# EAGLE design Foot.SMD.V1 (EAGLE 7.1.0)
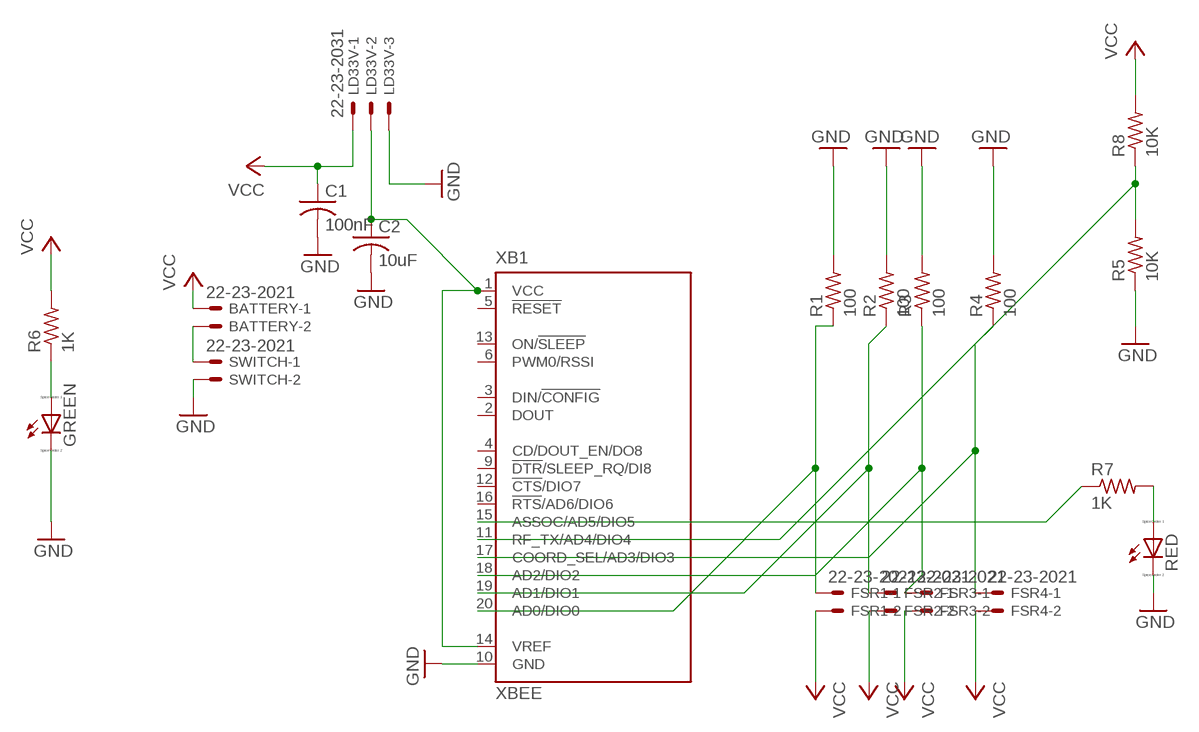
[diagram p0: schematic, sheet 1]

## Parts
BATTERY  22-23-2021  [22-23-2021]
C1  100nF  C-USC1206  [C1206]
C2  10uF  C-USC1206  [C1206]
FSR1  22-23-2021  [22-23-2021]
FSR2  22-23-2021  [22-23-2021]
FSR3  22-23-2021  [22-23-2021]
FSR4  22-23-2021  [22-23-2021]
GREEN  LED_E  [LED_1206]
LD33V  22-23-2031  [22-23-2031]
R1  100  R-US_M1206  [M1206]
R2  100  R-US_M1206  [M1206]
R3  100  R-US_M1206  [M1206]
R4  100  R-US_M1206  [M1206]
R5  10K  R-US_M1206  [M1206]
R6  1K  R-US_M1206  [M1206]
R7  1K  R-US_M1206  [M1206]
R8  10K  R-US_M1206  [M1206]
RED  LED_E  [LED_1206]
SWITCH  22-23-2021  [22-23-2021]
XB1  XBEE  [XBEE]

## Nets
GND: C1.2 C2.2 GREEN.C LD33V.3 R1.2 R2.2 R3.2 R4.2 R5.1 RED.C SWITCH.2 XB1.10(GND)
N$1: R5.2 R8.1 XB1.11(RF_TX/AD4/DIO4)
N$2: GREEN.A R6.1
N$3: R7.2 RED.A
N$4: BATTERY.2 SWITCH.1
N$5: C2.1 LD33V.2 XB1.1(VCC) XB1.14(VREF)
N$6: FSR1.1 R1.1 XB1.20(AD0/DIO0)
N$7: FSR2.1 R2.1 XB1.19(AD1/DIO1)
N$8: FSR3.1 R3.1 XB1.18(AD2/DIO2)
N$9: FSR4.1 R4.1 XB1.17(COORD_SEL/AD3/DIO3)
N$10: R7.1 XB1.15(ASSOC/AD5/DIO5)
VCC: BATTERY.1 C1.1 FSR1.2 FSR2.2 FSR3.2 FSR4.2 LD33V.1 R6.2 R8.2
Unconnected: XB1.2(DOUT) XB1.3(DIN/!CONFIG) XB1.4(CD/DOUT_EN/DO8) XB1.5(!RESET) XB1.6(PWM0/RSSI) XB1.9(!DTR!/SLEEP_RQ/DI8) XB1.12(!CTS!/DIO7) XB1.13(ON/!SLEEP) XB1.16(!RTS!/AD6/DIO6)

## Library data of the parts
BATTERY FSR1-FSR4 SWITCH = con-molex:22-23-2021: .100" (2.54mm) Center Header - 2 Pin; MF: MOLEX; MPN: 22-23-2021; OC_FARNELL: 1462926; OC_NEWARK: 25C3832
C1 C2 = rcl:C-US: CAPACITOR, American symbol
GREEN RED = eagle-ltspice:LED_E: LED Source: http://www.osram.convergy.de Source: www.luxeon.com Source: www.kingbright.com; SPICEMODEL: NONE; SPICEPREFIX: D; SPICETYPE: diode
LD33V = con-molex:22-23-2031: .100" (2.54mm) Center Header - 3 Pin; MF: MOLEX; MPN: 22-23-2031; OC_FARNELL: 1462950; OC_NEWARK: 30C0862
R1-R8 = rcl:R-US_: RESISTOR, American symbol
XB1 = maxstream:XBEE: XBee (TM) /XBee-PRO(TM) OEM RF Modules Source: MaxStream, Inc. xbee_productmanual.pdf; MPN: XBP24-Z7UIT-004; OC_FARNELL: 1751799; OC_NEWARK: 34R5507

## Board
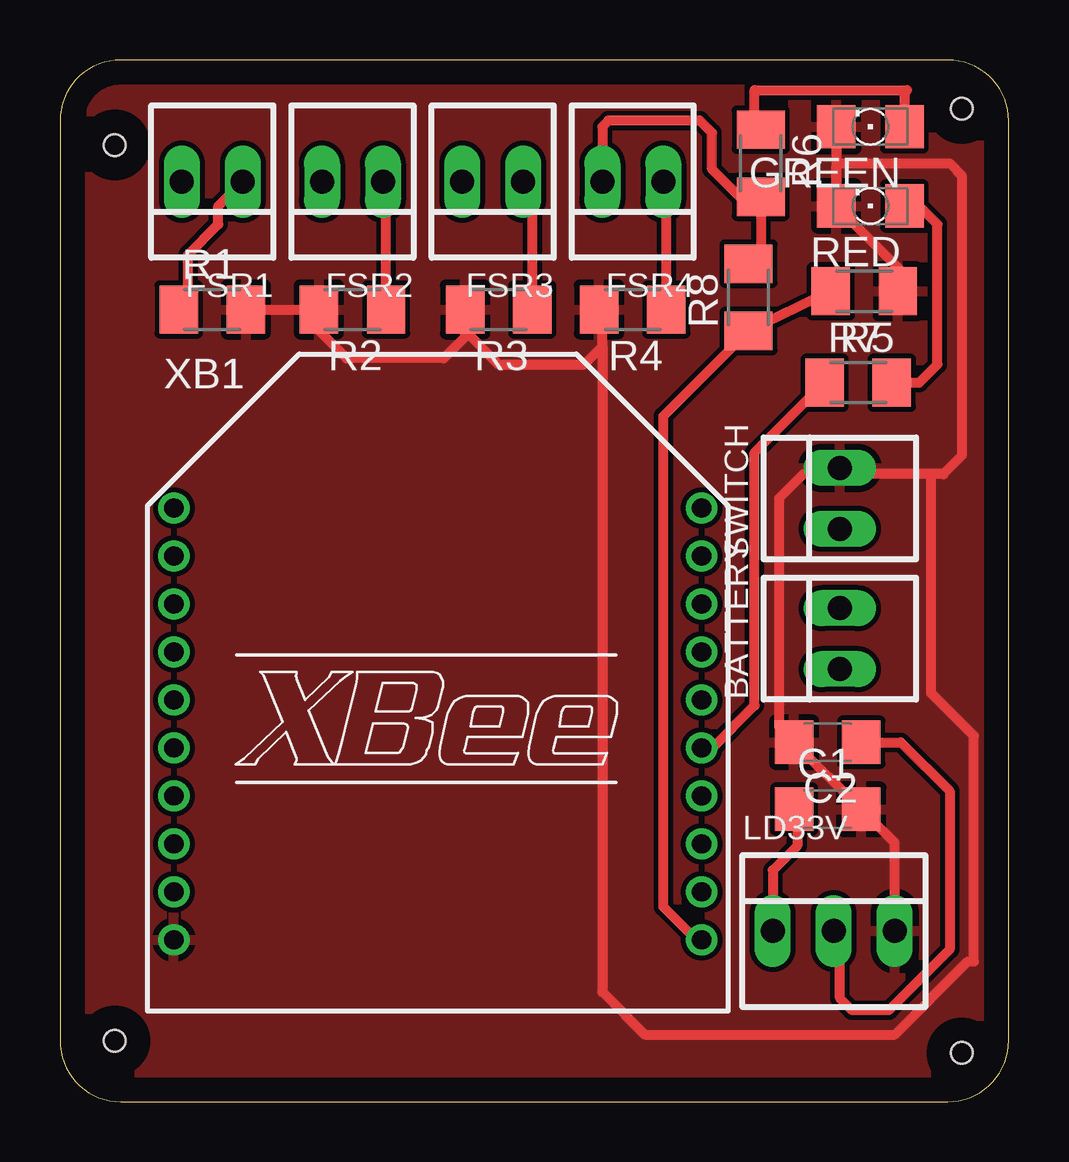
[diagram p1: board, top side]
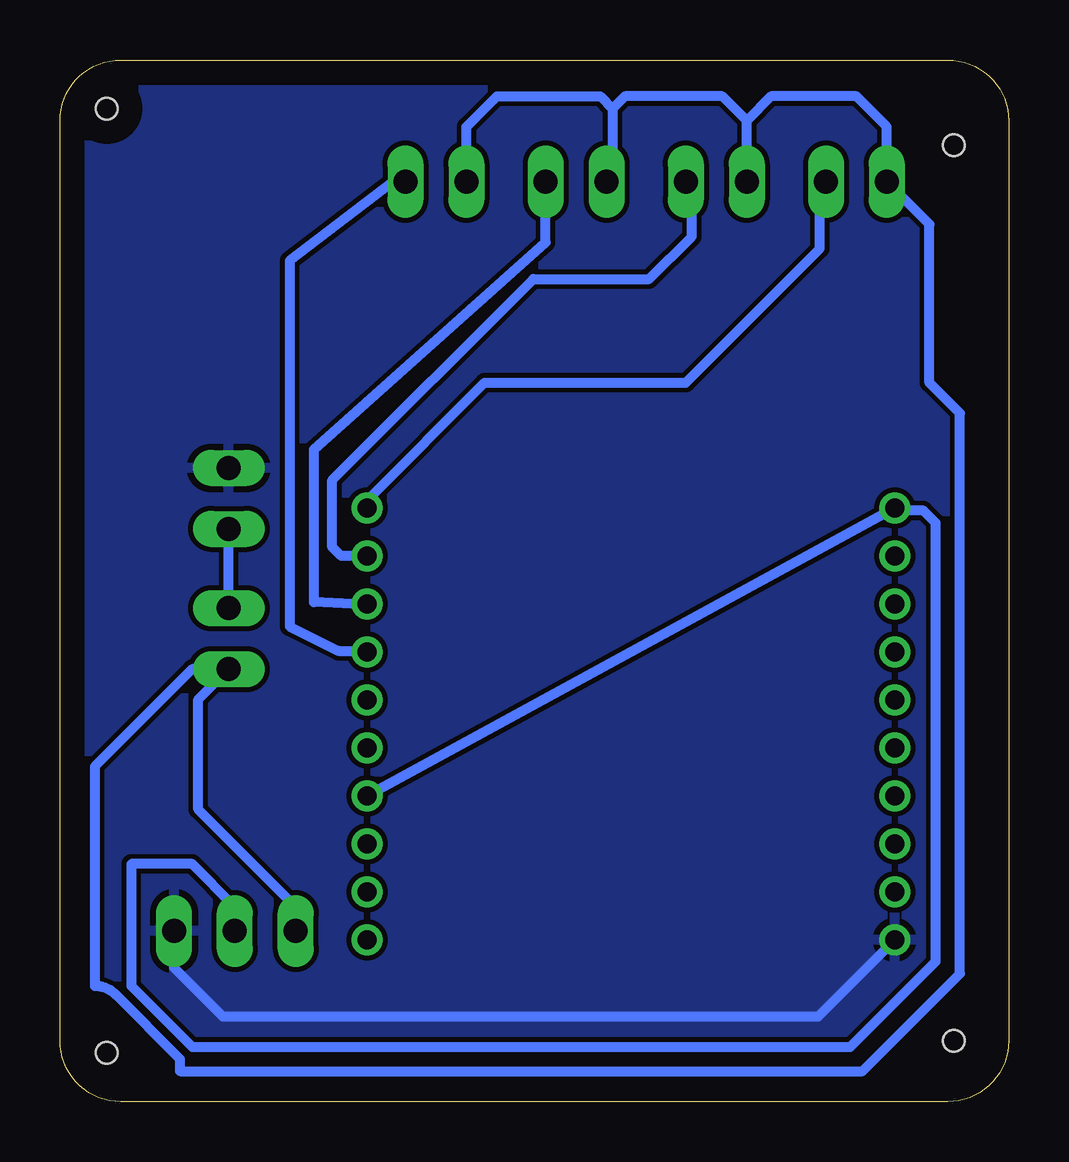
[diagram p2: board, bottom side, seen from below]

Size 39.55 x 43.42 mm. Coordinates in mm from the lower left corner, seen from the top.
Outline: 37.01,43.42 2.54,43.42 arc90 0,40.88 0,2.54 arc90 2.54,0 37.01,0 arc90 39.55,2.54 39.55,40.88 arc90 37.01,43.42
Copper layers (1*16): Top 0.035mm / dielectric 1.5mm / Bottom 0.035mm
Design rules "default": minimum track width 10mil, minimum drill 24mil, track to track 8mil, track to pad 8mil, pad to pad 8mil, via to via 8mil, smd to smd 8mil, copper to edge 40mil, drill to drill 8mil, minimum pad ring 10mil, minimum via ring 8mil, stop-mask expansion 4mil, vias tented up to drill 0mil, thermal gap 10mil
Holes 0.9 mm at 2.29,39.88 2.29,2.54 37.59,41.4 37.59,2.03

### Footprints (pad centres in the part's own frame; a part is rotated, then mirrored left to right if it is on the bottom)
22-23-2021 = drill 1 long: 1 -1.27,0; 2 1.27,0
C1206 = smd 1.6 x 1.8: 1 -1.4,0; 2 1.4,0
LED_1206 = smd 1.6 x 1.803: A -1.422,0; C 1.422,0
22-23-2031 = drill 1 long: 1 -2.54,0; 2 0,0; 3 2.54,0
M1206 = smd 1.6 x 2: 1 -1.4,0; 2 1.4,0
XBEE = drill 0.8 pad 1.27: 1 -11,9; 2 -11,7; 3 -11,5; 4 -11,3; 5 -11,1; 6 -11,-1; 7 -11,-3; 8 -11,-5; 9 -11,-7; 10 -11,-9; 11 11,-9; 12 11,-7; 13 11,-5; 14 11,-3; 15 11,-1; 16 11,1; 17 11,3; 18 11,5; 19 11,7; 20 11,9

### Placement (x,y rotation side)
BATTERY  32.51,19.3 90 top
C1  32,12.19 0 top
C2  32,14.99 180 top
FSR1  6.35,38.35 180 top
FSR2  12.19,38.35 180 top
FSR3  18.03,38.35 180 top
FSR4  23.88,38.35 180 top
GREEN  33.78,40.64 180 top
LD33V  32.26,7.11 0 top
R1  6.35,33.02 0 top
R2  12.19,33.02 180 top
R3  18.29,33.02 180 top
R4  23.88,33.02 180 top
R5  33.53,33.78 180 top
R6  29.21,39.12 270 top
R7  33.27,29.97 0 top
R8  28.7,33.53 90 top
RED  33.78,37.34 180 top
SWITCH  32.51,25.15 90 top
XB1  15.75,15.75 0 top

### Tracks (layer width: path | path; a pad name or v marks a point on that pad's centre or on a via)
GND
  Top 0.406: R1.2 R2.2 10.79,32.9 10.92,32.77 10.92,32.51 10.67,32.26 11.94,30.99 16,30.99 16.89,31.87 R3.2 16.89,32.13 18.29,30.73 21.84,30.73 22.61,31.5 | 22.61,31.5 22.61,32.89 R4.2 | GREEN.C RED.C | LD33V.3 34.8,10.8 C1.2 C2.2 29.97,15.62 29.97,25.15 30.99,26.16 32.77,26.16 | RED.C 32.36,38.96 32.51,39.12 37.08,39.12 37.59,38.61 37.59,26.92 36.83,26.16 36.32,26.16 | 36.32,26.16 32.77,26.16 | 32.77,26.16 SWITCH.2 | R5.1 34.93,34.77 RED.C | 22.61,31.5 22.61,4.57 24.38,2.79 34.8,2.79 37.85,5.84 38.1,5.84 38.1,15.24 36.32,17.02 36.32,26.16
  Bottom 0.406: LD33V.3 34.8,5.59 32.77,3.56 7.94,3.56 XB1.10
  pour Top: 0.76,3.81 0.76,40.13 arc-90 3.3,42.93 36.32,42.93 arc-90 38.86,40.13 38.86,3.81 arc-90 36.58,0.76 3.3,0.76 arc-90
  pour Bottom: 0.76,3.3 0.76,40.13 arc-90 3.3,42.93 36.32,42.93 arc-90 38.86,40.13 38.86,3.3 arc-90 36.32,0.76 3.3,0.76 arc-90
N$1
  Top 0.406: XB1.11 26.53,6.75 25.15,8.13 25.15,28.57 R8.1 R5.2
N$2
  Top 0.406: R6.1 arc-45 28.96,41.13 28.96,42.16 35.31,42.16 arc45 35.2,41.92 GREEN.A
N$3
  Top 0.406: RED.A 35.81,37.34 36.58,36.58 36.58,30.73 35.81,29.97 R7.2
N$4
  Bottom 0.406: BATTERY.2 SWITCH.1
N$5
  Top 0.406: C2.1 35.05,14.99 37.08,12.95 37.08,6.35 34.54,3.81 33.02,3.81 32.51,4.32 32.51,6.86 LD33V.2
  Bottom 0.406: XB1.14 XB1.1 4.64,24.64 3.56,24.64 3.05,24.13 3.05,5.84 6.6,2.29 34.04,2.29 36.58,4.83 36.58,9.91 34.04,9.91 32.26,8.13 LD33V.2
N$6
  Top 0.406: R1.1 5.08,33.02 5.33,33.27 5.33,35.31 6.6,36.58 6.6,37.34 FSR1.1
  Bottom 0.406: XB1.20 26.75,25.07 21.84,29.97 13.46,29.97 7.87,35.56 7.87,38.1 FSR1.1
N$7
  Top 0.406: R2.1 13.59,38.22 FSR2.1
  Bottom 0.406: XB1.19 27.83,22.75 28.19,23.11 28.19,25.91 19.81,34.29 14.99,34.29 13.21,36.07 13.21,38.1 FSR2.1
N$8
  Top 0.406: R3.1 19.69,37.97 FSR3.1
  Bottom 0.406: XB1.18 27.35,20.75 28.96,20.83 28.96,27.18 19.3,35.81 FSR3.1
N$9
  Top 0.406: R4.1 25.28,38.22 FSR4.1
  Bottom 0.406: FSR4.1 25.65,38.35 29.97,35.05 29.97,19.81 27.94,18.8 26.8,18.8 XB1.17
N$10
  Top 0.406: XB1.15 27.19,14.75 28.96,16.51 28.96,27.05 R7.1
VCC
  Top 0.406: C1.1 30.73,12.19 30.73,10.67 29.72,9.65 LD33V.1 | FSR4.2 22.61,40.64 22.86,40.89 26.67,40.89 27.18,40.39 27.18,38.86 28.32,37.72 R6.2 29.21,35.44 R8.2
  Bottom 0.406: 10.92,40.89 9.91,41.91 6.35,41.91 5.08,40.64 FSR1.2 3.3,36.58 3.3,29.97 2.03,28.7 2.03,5.33 6.1,1.27 34.54,1.27 34.54,1.78 37.23,4.47 arc-45 38.1,4.83 38.1,13.97 34.04,18.03 BATTERY.1 33.78,16.76 33.78,12.19 29.72,8.13 LD33V.1 | FSR2.2 10.92,40.89 | 10.92,40.89 11.94,41.91 16,41.91 16.51,41.4 | 16.51,41.4 16.51,38.61 FSR3.2 | FSR4.2 22.61,40.64 21.34,41.91 17.02,41.91 16.51,41.4